# Altium schematic sheet [11] - EEPROM.SchDoc
size A3; DocumentNumber: 12; SheetNumber: 12; SheetTotal: 12
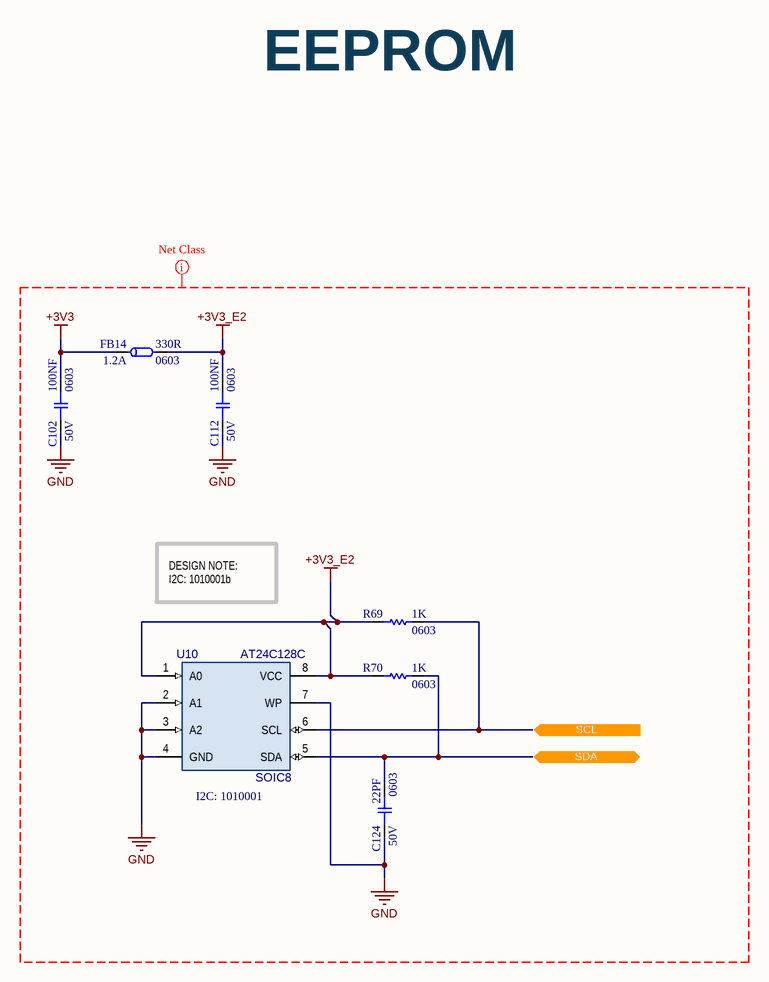
[diagram p0: [11] - EEPROM.SchDoc]

## Parts
C102  100NF  Voltage Rating: 50V  Case/Package: 0603  [C-0603]
C112  100NF  Voltage Rating: 50V  Case/Package: 0603  [C-0603]
C124  22PF  Voltage Rating: 50V  Case/Package: 0603  [C-0603]
FB14  330R  Case/Package: 0603  DC Current: 1.2A  [FB-0603]
R69  1K  Case Code (Imperial): 0603  [R-0603]
R70  1K  Case Code (Imperial): 0603  [R-0603]
U10  AT24C128C  [SOIC8]

## Ports
SCL (in), SDA (bidir)

## Nets
+3V3: C102.2 FB14.1
+3V3_E2: C112.2 FB14.2 R69.1 R70.1 U10.1(A0) U10.8(VCC)
GND: C102.1 C112.1 C124.1 U10.2(A1) U10.3(A2) U10.4(GND) U10.7(WP)
SCL: R69.2 U10.6(SCL) ; port SCL
SDA: C124.2 R70.2 U10.5(SDA) ; port SDA

## Layout directives
net class EEPROM: +3V3, +3V3_E2, GND

## Notes on the sheet
- EEPROM
- DESIGN NOTE:
  I2C: 1010001b
- (near U10) I2C: 1010001
- Date
- Name
- Product
- Variante:
- Editor
- Check
- Ref.
- Schematic
- File
- PCB-Number
- Rev.
- Description
- Sheet Size
- A3
- Sheet:
- /

## Library data of the parts
C102 C112 = C-100NF-0603: CAP CER 0.1UF 50V X7R 0603; Manufacturer: TDK; Manufacturer Part Number: C1608X7R1H104K080AA; Tolerance: 10%; Dielectric Material: Ceramic; .PCBCHK: CHECKED; .Creator: F:TALI; Temperature Coefficient: 30ppm/°C; Supplier 1: Digi-Key; Supplier Part Number 1: 445-1314-1-ND; Stock 1: 0; Pricing 1: 1=0.1, 10=0.057, 100=0.0254, 500=0.01812, 1000=0.01423 (USD); Mount: Surface Mount; Number of Pins: 2; Case Code (Metric): 1608; Case Code (Imperial): 0603; Min Operating Temperature: -55°C; Max Operating Temperature: 125°C; Capacitance: 100nF; Package Quantity: 1; Packaging: Tape and Reel; Voltage Rating (DC): 50V; Dielectric: X7R; Termination: SMD/SMT; Composition: Ceramic; Voltage: 50V; Length: 1.6mm; Height: 0.8mm; Width: 0.8mm; Thickness: 0.037inch; Depth: 0.8mm; Radiation Hardening: No; REACH SVHC: No SVHC; Lead Free: Lead Free; ComponentLink1URL: http://www.mouser.com/ds/2/400/lcc_commercial_general_en-837201.pdf; ComponentLink1Description: http://www.mouser.com/ds/2/400/lcc_commercial_general_en-837201.pdf; ComponentLink2URL: https://product.tdk.com/info/en/catalog/spec/mlccspec_commercial_general_midvoltage_en.pdf; ComponentLink2Description: https://product.tdk.com/info/en/catalog/spec/mlccspec_commercial_general_midvoltage_en.pdf; ComponentLink3URL: http://uk.rs-online.com/webdocs/13d1/0900766b813d1103.pdf; ComponentLink3Description: http://uk.rs-online.com/webdocs/13d1/0900766b813d1103.pdf; ComponentLink4URL: http://www.tdk.co.jp/tefe02/e412_c.pdf; ComponentLink4Description: http://www.tdk.co.jp/tefe02/e412_c.pdf; ComponentLink5URL: http://www.farnell.com/datasheets/2291921.pdf; ComponentLink5Description: http://www.farnell.com/datasheets/2291921.pdf; Supplier 2: Digi-Key; Supplier Part Number 2: 478-3540-6-ND; Stock 2: 40000; Pricing 2: 1=0.23, 10=0.161, 100=0.0756, 500=0.05304, 1000=0.0439 (USD); ComponentLink6URL: http://www.farnell.com/datasheets/1744655.pdf; ComponentLink6Description: http://www.farnell.com/datasheets/1744655.pdf; Contact Plating: Matte,Tin; ComponentLink7URL: http://catalogs.avx.com/SurfaceMount.pdf; ComponentLink7Description: http://catalogs.avx.com/SurfaceMount.pdf; ComponentLink8URL: http://www.farnell.com/datasheets/630895.pdf; ComponentLink8Description: http://www.farnell.com/datasheets/630895.pdf; ComponentLink9URL: http://www.avx.com/docs/Catalogs/cx7r.pdf; ComponentLink9Description: http://www.avx.com/docs/Catalogs/cx7r.pdf; .SCHCHK: CHECKED; Weight: 7.1E-05oz; Features: Soft Termination; ComponentLink10URL: http://www.avx.com/docs/catalogs/cauto.pdf; ComponentLink10Description: http://www.avx.com/docs/catalogs/cauto.pdf; ComponentLink11URL: https://www.verical.com/server-webapp/html/getDatasheet?partID=98691; ComponentLink11Description: https://www.verical.com/server-webapp/html/getDatasheet?partID=98691; ComponentLink12URL: https://www.avx.com/docs/Catalogs/flexiterm.pdf; ComponentLink12Description: https://www.avx.com/docs/Catalogs/flexiterm.pdf
C124 = C-22PF-0603: CAP CER 22PF 50V C0G/NP0 0603; Manufacturer: Samsung; Manufacturer Part Number: CL10C220JB8NNNC; Dielectric Material: Ceramic; Tolerance: 5%; Dielectric: C0G; .PCBCHK: USED; .Creator: F:TALI; Temperature Coefficient: 300ppm/°C; Insulation Resistance: 100GR; Washability: OK; Supplier 1: Digi-Key; Supplier Part Number 1: 1276-1023-6-ND; Stock 1: 0; Pricing 1: 1=0.1, 10=0.056, 100=0.0251, 500=0.0179, 1000=0.01406 (USD); Mount: Surface Mount; Number of Pins: 2; Case Code (Metric): 1608; Min Operating Temperature: -55°C; Max Operating Temperature: 125°C; Packaging: Tape and Reel; Package Quantity: 1; Voltage Rating (DC): 50V; Termination: SMD/SMT; Voltage: 50V; Length: 1.6mm; Height: 0.8mm; Width: 0.031inch; Thickness: 0.035inch; Depth: 0.8mm; Radiation Hardening: No; REACH SVHC: No SVHC; Lead Free: Lead Free; ComponentLink1URL: http://www1.futureelectronics.com/doc/SAMSUNG%20PASSIVE/CL05B104KQ5NNNC.pdf; ComponentLink1Description: http://www1.futureelectronics.com/doc/SAMSUNG%20PASSIVE/CL05B104KQ5NNNC.pdf; ComponentLink2URL: https://media.digikey.com/pdf/Data%20Sheets/Samsung%20PDFs/CL_Series_MLCC_ds.pdf; ComponentLink2Description: https://media.digikey.com/pdf/Data%20Sheets/Samsung%20PDFs/CL_Series_MLCC_ds.pdf; ComponentLink3URL: https://www.distrelec.biz/Web/Downloads/_e/ng/MLCC_CatalogDownload2013_ENG.pdf?mime=application%2Fpdf; ComponentLink3Description: https://www.distrelec.biz/Web/Downloads/_e/ng/MLCC_CatalogDownload2013_ENG.pdf?mime=application%2Fpdf; ComponentLink4URL: https://produktinfo.conrad.com/datenblaetter/450000-474999/457135-da-01-en-VS_KONDENSATOR_0603.pdf; ComponentLink4Description: https://produktinfo.conrad.com/datenblaetter/450000-474999/457135-da-01-en-VS_KONDENSATOR_0603.pdf; ComponentLink5URL: http://www.avx.com/docs/Catalogs/ccog.pdf; ComponentLink5Description: http://www.avx.com/docs/Catalogs/ccog.pdf; Capacitance: 22pF; Case Code (Imperial): 0603; Stock 2: 40000; Pricing 2: 1=0.1, 10=0.073, 100=0.0324, 500=0.02314, 1000=0.01818 (USD); Stock 3: 3383; Pricing 3: 1=0.1, 10=0.048, 100=0.0214, 500=0.01532, 1000=0.01203 (USD); ComponentLink6URL: https://www.verical.com/server-webapp/html/getDatasheet?partID=60906; ComponentLink6Description: https://www.verical.com/server-webapp/html/getDatasheet?partID=60906; .SCHCHK: USED; Material: Ceramic; Contact Plating: Tin; ComponentLink7URL: http://www.farnell.com/datasheets/759117.pdf; ComponentLink7Description: http://www.farnell.com/datasheets/759117.pdf; ComponentLink8URL: http://catalogs.avx.com/SurfaceMount.pdf; ComponentLink8Description: http://catalogs.avx.com/SurfaceMount.pdf; ComponentLink9URL: http://uk.rs-online.com/webdocs/140c/0900766b8140c8fe.pdf; ComponentLink9Description: http://uk.rs-online.com/webdocs/140c/0900766b8140c8fe.pdf; ComponentLink10URL: http://www1.futureelectronics.com/doc/SAMSUNG/CL10C220JB8NFNC.pdf; ComponentLink10Description: http://www1.futureelectronics.com/doc/SAMSUNG/CL10C220JB8NFNC.pdf; ComponentLink11URL: http://www.samsungsem.com/kr/support/product-search/mlcc/CL10C220JB8NFNC.jsp; ComponentLink11Description: http://www.samsungsem.com/kr/support/product-search/mlcc/CL10C220JB8NFNC.jsp
FB14 = FB-330R-0603: FERRITE BEAD 330 OHM 0603 1LN; Manufacturer: Murata; Manufacturer Part Number: BLM18PG331SN1D; Material: Steel,Ferrite; Tolerance: 25%; DC Resistance (DCR): 150mR; Number of Lines: 1; Test Frequency: 100MHz; Shielding: Unshielded; Supplier 1: Avnet; Stock 1: 132000; Pricing 1: 4000=0,01997, 8000=0,01922, 16000=0,01852, 24000=0,01785, 40000=0,01756 (USD); RoHS: Yes; Number of Pins: 2; Core Material: Ferrite; Case Code (Metric): 1608; Case Code (Imperial): 0603; Min Operating Temperature: -55°C; Max Operating Temperature: 125°C; Impedance: 330R; Package Quantity: 1; Packaging: Tape and Reel; Current Rating: 1.2A; Max Current Rating: 1.2A; Termination: SMD/SMT; Number of Circuits: 1; Length: 1.75mm; Height: 0.8mm; Width: 0.8mm; Depth: 0.95mm; Radiation Hardening: No; REACH SVHC: No SVHC; Lead Free: Lead Free; ComponentLink1URL: https://datasheet.ciiva.com/6211/enfa0003-6211710.pdf?src-supplier=Digi-Key; ComponentLink1Description: https://datasheet.ciiva.com/6211/enfa0003-6211710.pdf?src-supplier=Digi-Key; Supplier Part Number 1: BLM18PG331SN1D; Max DC Current: 1.2A
R69 R70 = R-1K-0603: RES SMD 1K OHM 5% 1/10W 0603; Manufacturer: Yageo; Manufacturer Part Number: RC0603JR-071KL; Resistance: 1kR; Temperature Coefficient: 100ppm/°C; Voltage Rating (DC): 50V; Power Rating: 100mW; Supplier 1: Digi-Key; Supplier Part Number 1: 311-1.0KGRCT-ND; Stock 1: 16415399; Pricing 1: 1=0.09, 10=0.019, 100=0.0077, 1000=0.00346, 2500=0.00301 (EUR); Case/Package: 0603; Number of Pins: 2; Contact Plating: Matte,Tin; Case Code (Metric): 1608; Min Operating Temperature: -55°C; Max Operating Temperature: 155°C; Tolerance: 5%; Composition: Thick Film; Packaging: Tape and Reel; Package Quantity: 5000; Voltage Rating: 50V; Termination: SMD/SMT; Military Standard: Not; Length: 1.6mm; Height: 0.45mm; Width: 0.8mm; Depth: 0.8mm; Radiation Hardening: No; REACH SVHC: Unknown; Lead Free: Lead Free; ComponentLink1URL: http://www.yageo.com/documents/recent/PYu-RC_Group_51_RoHS_L_2.pdf; ComponentLink1Description: http://www.yageo.com/documents/recent/PYu-RC_Group_51_RoHS_L_2.pdf; ComponentLink2URL: http://www.farnell.com/datasheets/443971.pdf; ComponentLink2Description: http://www.farnell.com/datasheets/443971.pdf; Supplier 2: Digi-Key; Supplier Part Number 2: YAG1311CT-ND; Stock 2: 9; Pricing 2: 1=0.1, 10=0.044, 100=0.0178, 1000=0.00798, 2500=0.00693 (USD); Number of Terminations: 2; Max Power Dissipation: 100mW; Features: Moisture Resistant; Supplier Part Number 3: SMD0603-1K; Stock 3: 0; Pricing 3: 100=0.0125, 1000=0.0035, 5000=0.002, 15000=0.00165, 50000=0.0014 (USD); Supplier 3: Ozdisan
U10 = IC-AT24C128C-SSHM-B: IC EEPROM 128K I2C 1MHZ 8SOIC; Manufacturer: Microchip / Atmel; Access Time: 900ns; Density: 128Kb; Interface: 2-Wire,I2C,Serial; Max Supply Voltage: 5.5V; Min Supply Voltage: 1.7V; Nominal Supply Current: 3mA; Number of Words: 16384; Supplier 1: Digi-Key; Manufacturer Part Number: AT24C128C-SSHM-B; Stock 1: 1826; Pricing 1: 1=0.45, 10=0.443, 25=0.4116, 100=0.3636 (USD); Mount: Surface Mount; Number of Pins: 8; Contact Plating: Matte,Tin; Min Operating Temperature: -40°C; Max Operating Temperature: 85°C; Max Frequency: 1MHz; Frequency: 1MHz; Packaging: Bulk; Package Quantity: 100; Memory Type: EEPROM; Memory Size: 128Kb; Length: 5.05mm; Height: 1.5mm; Width: 3.99mm; Radiation Hardening: No; REACH SVHC: No SVHC; ComponentLink1URL: https://www.verical.com/server-webapp/html/getDatasheet?partID=319282; ComponentLink1Description: https://www.verical.com/server-webapp/html/getDatasheet?partID=319282; ComponentLink2URL: http://www.microchip.com/mymicrochip/filehandler.aspx?ddocname=en589922; ComponentLink2Description: http://www.microchip.com/mymicrochip/filehandler.aspx?ddocname=en589922; ComponentLink3URL: http://www.farnell.com/datasheets/1726559.pdf; ComponentLink3Description: http://www.farnell.com/datasheets/1726559.pdf; Supplier Part Number 1: AT24C128C-SSHM-B-ND; Case/Package: SOIC8